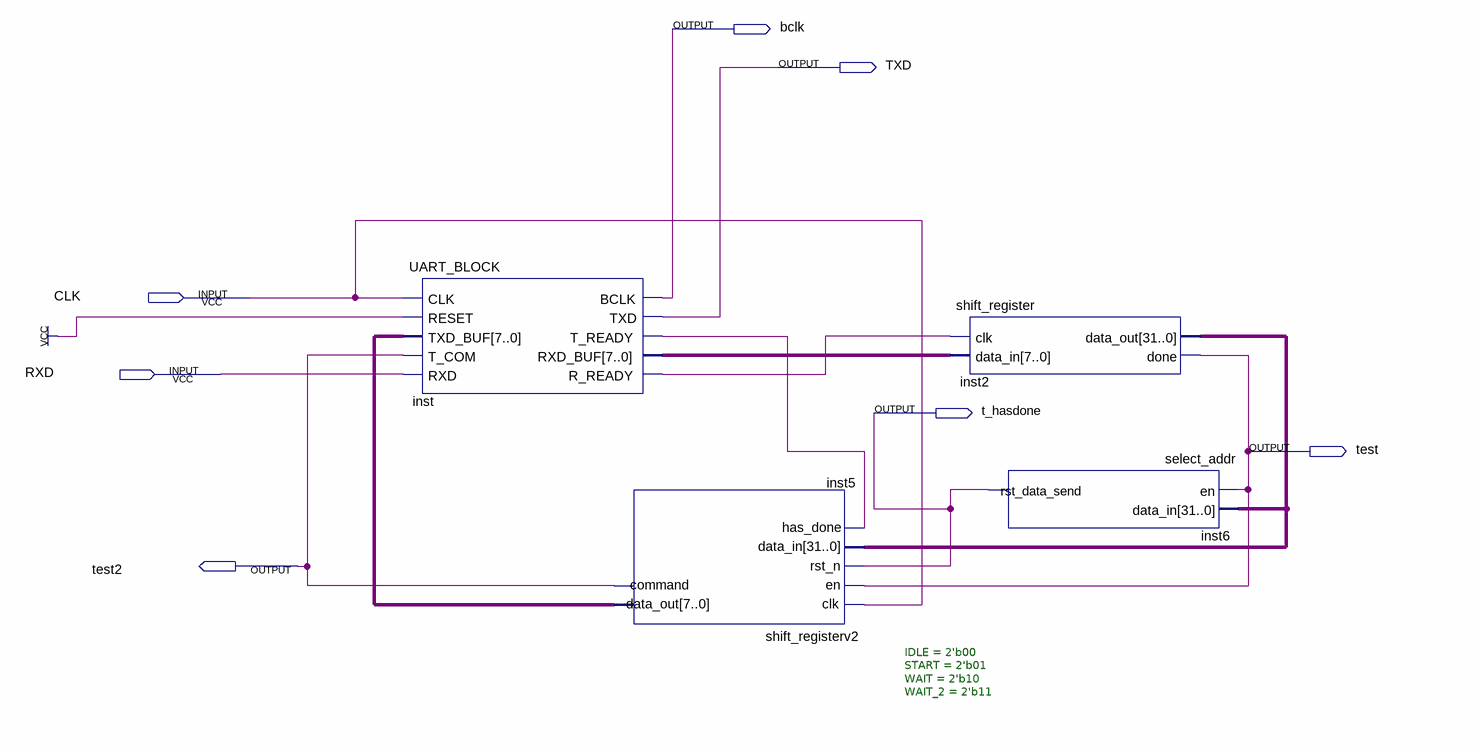
[diagram p0: schematic sheet]
// Quartus schematic UART_MAIN.bdf as structural Verilog: 4 symbols, 7 pins
module UART_MAIN (
  input  CLK,
  input  RXD,
  output bclk,
  output TXD,
  output t_hasdone,
  output test,
  output test2
);

  wire inst_r_ready, inst_t_ready;
  wire [7:0] inst5_data_out, inst_rxd_buf;
  wire [31:0] inst2_data_out;

  UART_BLOCK inst (
    .CLK(CLK), .RESET(1'b1), .TXD_BUF(inst5_data_out), .T_COM(test2), .RXD(RXD), .BCLK(bclk), .TXD(TXD),
    .T_READY(inst_t_ready), .RXD_BUF(inst_rxd_buf), .R_READY(inst_r_ready));
  shift_registerv2 #(.IDLE(2'b00), .START(2'b01), .WAIT(2'b10), .WAIT_2(2'b11)) inst5 (
    .clk(CLK), .en(test), .rst_n(t_hasdone), .data_in(inst2_data_out), .has_done(inst_t_ready),
    .data_out(inst5_data_out), .command(test2));
  shift_register inst2 (.clk(inst_r_ready), .data_in(inst_rxd_buf), .data_out(inst2_data_out), .done(test));
  select_addr inst6 (.en(test), .data_in(inst2_data_out), .rst_data_send(t_hasdone));
endmodule
